# EAGLE design PIN2DMD (EAGLE 7.4.0)
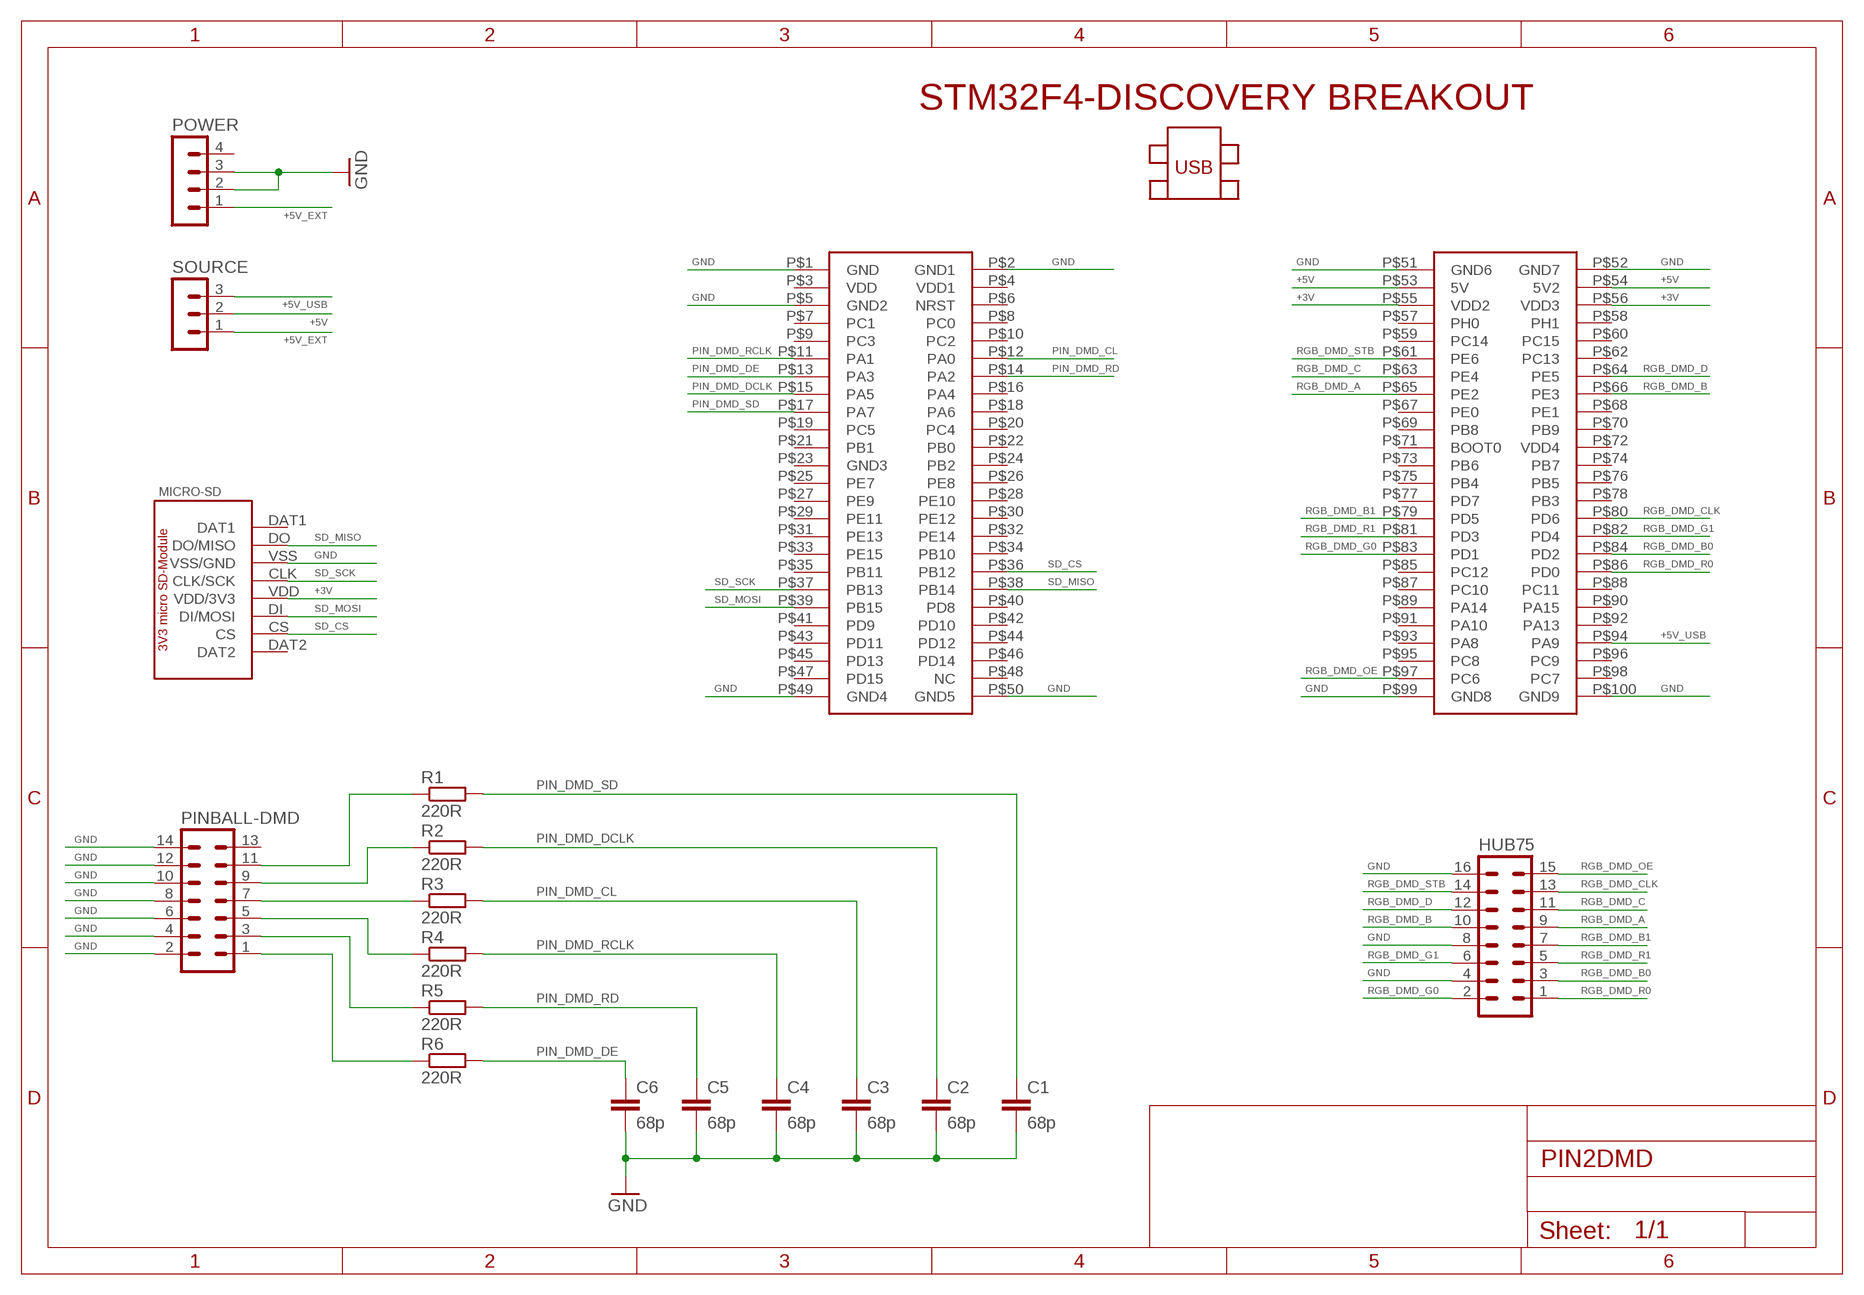
[diagram p0: schematic, sheet 1]

## Parts
C1  68p  C-EU025-024X044  [C025-024X044]
C2  68p  C-EU025-024X044  [C025-024X044]
C3  68p  C-EU025-024X044  [C025-024X044]
C4  68p  C-EU025-024X044  [C025-024X044]
C5  68p  C-EU025-024X044  [C025-024X044]
C6  68p  C-EU025-024X044  [C025-024X044]
HUB75  MA08-2  [MA08-2]
MICRO-SD  SPI_SDCARD_3V3_MICRO  [SPI_SDCARD_3V3_MICRO]
PINBALL-DMD  MA07-2  [MA07-2]
POWER  MA04-1  [MA04-1]
R1  220R  R-EU_0207/10  [0207/10]
R2  220R  R-EU_0207/10  [0207/10]
R3  220R  R-EU_0207/10  [0207/10]
R4  220R  R-EU_0207/10  [0207/10]
R5  220R  R-EU_0207/10  [0207/10]
R6  220R  R-EU_0207/10  [0207/10]
SOURCE  MA03-1  [MA03-1]
U$1  STM32F4-DISCOVERY  [STM32F4-DISCOVERY]

## Nets
+3V: MICRO-SD.VDD(VDD/3V3) U$1.P$55(VDD2) U$1.P$56(VDD3)
+5V: SOURCE.2 U$1.P$53(5V) U$1.P$54(5V2)
+5V_EXT: POWER.1 SOURCE.1
+5V_USB: SOURCE.3 U$1.P$94(PA9)
GND: C1.2 C2.2 C3.2 C4.2 C5.2 C6.2 HUB75.4 HUB75.8 HUB75.16 MICRO-SD.VSS(VSS/GND) PINBALL-DMD.2 PINBALL-DMD.4 PINBALL-DMD.6 PINBALL-DMD.8 PINBALL-DMD.10 PINBALL-DMD.12 PINBALL-DMD.14 POWER.2 POWER.3 U$1.P$1(GND) U$1.P$2(GND1) U$1.P$5(GND2) U$1.P$49(GND4) U$1.P$50(GND5) U$1.P$51(GND6) U$1.P$52(GND7) U$1.P$99(GND8) U$1.P$100(GND9)
N$5: PINBALL-DMD.7 R3.1
N$6: PINBALL-DMD.5 R4.1
N$11: PINBALL-DMD.3 R5.1
N$12: PINBALL-DMD.1 R6.1
N$13: PINBALL-DMD.9 R2.1
N$14: PINBALL-DMD.11 R1.1
PIN_DMD_CL: C3.1 R3.2 U$1.P$12(PA0)
PIN_DMD_DCLK: C2.1 R2.2 U$1.P$15(PA5)
PIN_DMD_DE: C6.1 R6.2 U$1.P$13(PA3)
PIN_DMD_RCLK: C4.1 R4.2 U$1.P$11(PA1)
PIN_DMD_RD: C5.1 R5.2 U$1.P$14(PA2)
PIN_DMD_SD: C1.1 R1.2 U$1.P$17(PA7)
RGB_DMD_A: HUB75.9 U$1.P$65(PE2)
RGB_DMD_B: HUB75.10 U$1.P$66(PE3)
RGB_DMD_B0: HUB75.3 U$1.P$84(PD2)
RGB_DMD_B1: HUB75.7 U$1.P$79(PD5)
RGB_DMD_C: HUB75.11 U$1.P$63(PE4)
RGB_DMD_CLK: HUB75.13 U$1.P$80(PD6)
RGB_DMD_D: HUB75.12 U$1.P$64(PE5)
RGB_DMD_G0: HUB75.2 U$1.P$83(PD1)
RGB_DMD_G1: HUB75.6 U$1.P$82(PD4)
RGB_DMD_OE: HUB75.15 U$1.P$97(PC6)
RGB_DMD_R0: HUB75.1 U$1.P$86(PD0)
RGB_DMD_R1: HUB75.5 U$1.P$81(PD3)
RGB_DMD_STB: HUB75.14 U$1.P$61(PE6)
SD_CS: MICRO-SD.CS U$1.P$36(PB12)
SD_MISO: MICRO-SD.DO(DO/MISO) U$1.P$38(PB14)
SD_MOSI: MICRO-SD.DI(DI/MOSI) U$1.P$39(PB15)
SD_SCK: MICRO-SD.CLK(CLK/SCK) U$1.P$37(PB13)
Unconnected: MICRO-SD.DAT1 MICRO-SD.DAT2 PINBALL-DMD.13 POWER.4 U$1.P$3(VDD) U$1.P$4(VDD1) U$1.P$6(NRST) U$1.P$7(PC1) U$1.P$8(PC0) U$1.P$9(PC3) U$1.P$10(PC2) U$1.P$16(PA4) U$1.P$18(PA6) U$1.P$19(PC5) U$1.P$20(PC4) U$1.P$21(PB1) U$1.P$22(PB0) U$1.P$23(GND3) U$1.P$24(PB2) U$1.P$25(PE7) U$1.P$26(PE8) U$1.P$27(PE9) U$1.P$28(PE10) U$1.P$29(PE11) U$1.P$30(PE12) U$1.P$31(PE13) U$1.P$32(PE14) U$1.P$33(PE15) U$1.P$34(PB10) U$1.P$35(PB11) U$1.P$40(PD8) U$1.P$41(PD9) U$1.P$42(PD10) U$1.P$43(PD11) U$1.P$44(PD12) U$1.P$45(PD13) U$1.P$46(PD14) U$1.P$47(PD15) U$1.P$48(NC) U$1.P$57(PH0) U$1.P$58(PH1) U$1.P$59(PC14) U$1.P$60(PC15) U$1.P$62(PC13) U$1.P$67(PE0) U$1.P$68(PE1) U$1.P$69(PB8) U$1.P$70(PB9) U$1.P$71(BOOT0) U$1.P$72(VDD4) U$1.P$73(PB6) U$1.P$74(PB7) U$1.P$75(PB4) U$1.P$76(PB5) U$1.P$77(PD7) U$1.P$78(PB3) U$1.P$85(PC12) U$1.P$87(PC10) U$1.P$88(PC11) U$1.P$89(PA14) U$1.P$90(PA15) U$1.P$91(PA10) U$1.P$92(PA13) U$1.P$93(PA8) U$1.P$95(PC8) U$1.P$96(PC9) U$1.P$98(PC7)

## Library data of the parts
C1-C6 = resistor:C-EU: CAPACITOR, European symbol
HUB75 = con-lstb:MA08-2: PIN HEADER
MICRO-SD = zzz_Sascha:SPI_SDCARD_3V3_MICRO: micro SD Card Modul 3V3
PINBALL-DMD = con-lstb:MA07-2: PIN HEADER
POWER = con-lstb:MA04-1: PIN HEADER
R1-R6 = rcl:R-EU_: RESISTOR, European symbol
SOURCE = con-lstb:MA03-1: PIN HEADER
U$1 = STM32F4-DISCOVERY:STM32F4-DISCOVERY

## Board
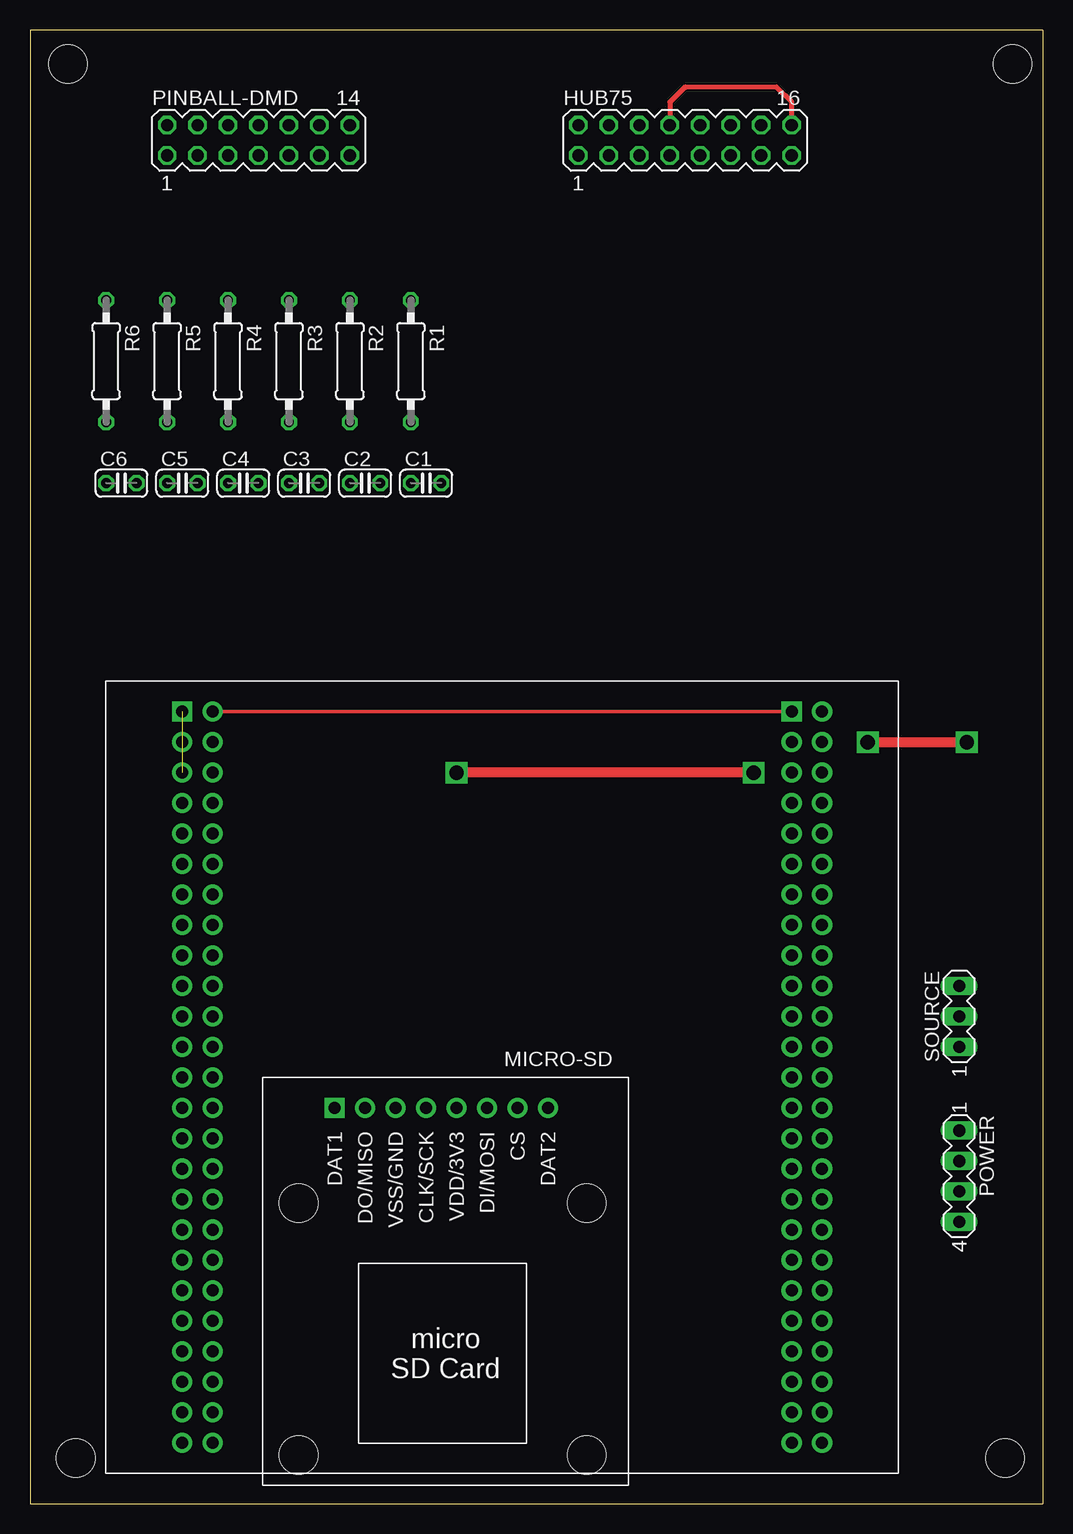
[diagram p1: board, top side]
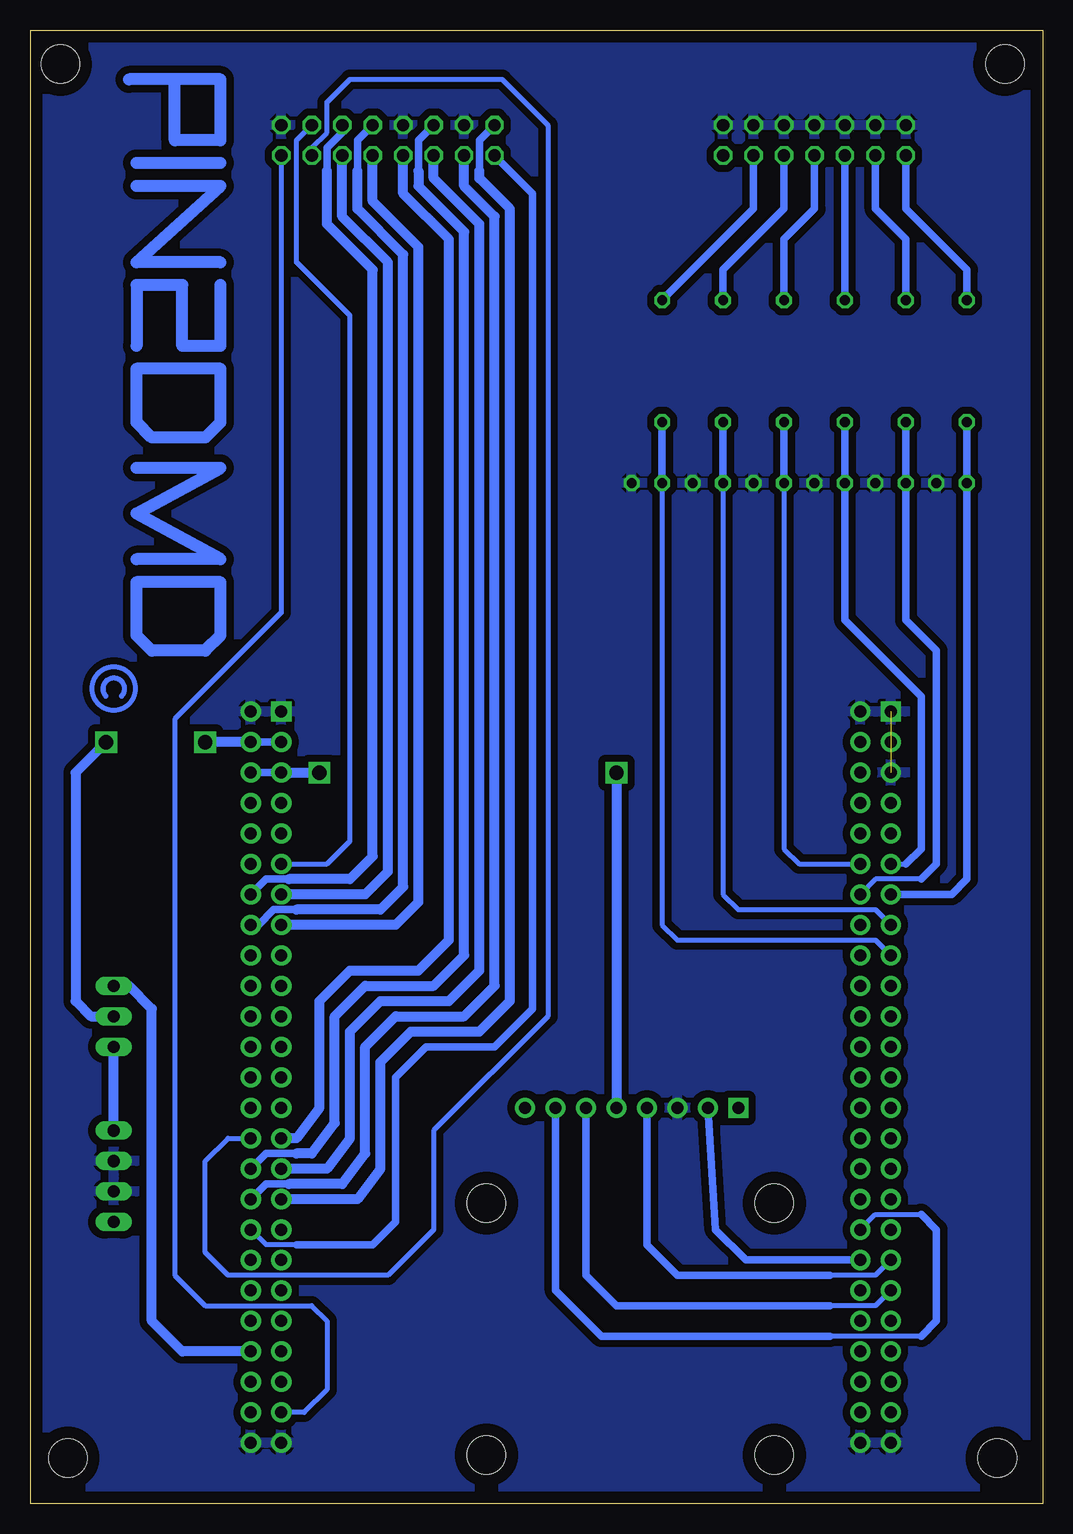
[diagram p2: board, bottom side, seen from below]

Size 84.45 x 122.86 mm. Coordinates in mm from the lower left corner, seen from the top.
Outline: 0,0 84.45,0 84.45,122.86 0,122.86 0,0
Copper layers (1*16): Top 0.035mm / dielectric 1.5mm / Bottom 0.035mm
Design rules "default": minimum track width 10mil, minimum drill 24mil, track to track 8mil, track to pad 8mil, pad to pad 8mil, via to via 8mil, smd to smd 8mil, copper to edge 40mil, drill to drill 8mil, minimum pad ring 10mil, minimum via ring 8mil, stop-mask expansion 4mil, vias tented up to drill 0mil, thermal gap 10mil
Holes 3.2 mm at 3.17,120.02 3.81,3.81 81.28,3.81 81.92,120.02

### Footprints (pad centres in the part's own frame; a part is rotated, then mirrored left to right if it is on the bottom)
C025-024X044 = drill 0.813 octagon: 1 -1.27,0; 2 1.27,0
MA08-2 = drill 1.016 octagon: 1 -8.89,-1.27; 2 -8.89,1.27; 3 -6.35,-1.27; 4 -6.35,1.27; 5 -3.81,-1.27; 6 -3.81,1.27; 7 -1.27,-1.27; 8 -1.27,1.27; 9 1.27,-1.27; 10 1.27,1.27; 11 3.81,-1.27; 12 3.81,1.27; 13 6.35,-1.27; 14 6.35,1.27; 15 8.89,-1.27; 16 8.89,1.27
SPI_SDCARD_3V3_MICRO = drill 1 pad 1.676: CLK -7.62,0; CS -15.24,0; DAT2 -17.78,0; DI -12.7,0; DO -2.54,0; VDD -10.16,0; VSS -5.08,0 | drill 1 pad 1.676 square: DAT1 0,0 | hole 3.2: -21,7.96; -21,28.96; 3,7.96; 3,28.96
MA07-2 = drill 1.016 octagon: 1 -7.62,-1.27; 2 -7.62,1.27; 3 -5.08,-1.27; 4 -5.08,1.27; 5 -2.54,-1.27; 6 -2.54,1.27; 7 0,-1.27; 8 0,1.27; 9 2.54,-1.27; 10 2.54,1.27; 11 5.08,-1.27; 12 5.08,1.27; 13 7.62,-1.27; 14 7.62,1.27
MA04-1 = drill 1.016 long: 1 -3.81,0; 2 -1.27,0; 3 1.27,0; 4 3.81,0
0207/10 = drill 0.813 octagon: 1 -5.08,0; 2 5.08,0
MA03-1 = drill 1.016 long: 1 -2.54,0; 2 0,0; 3 2.54,0
STM32F4-DISCOVERY = drill 1 pad 1.676 square: P$1 -27.94,30.48; P$51 22.86,30.48 | drill 1 pad 1.676: P$2 -25.4,30.48; P$3 -27.94,27.94; P$4 -25.4,27.94; P$5 -27.94,25.4; P$6 -25.4,25.4; P$7 -27.94,22.86; P$8 -25.4,22.86; P$9 -27.94,20.32; P$10 -25.4,20.32; P$11 -27.94,17.78; P$12 -25.4,17.78; P$13 -27.94,15.24; P$14 -25.4,15.24; P$15 -27.94,12.7; P$16 -25.4,12.7; P$17 -27.94,10.16; P$18 -25.4,10.16; P$19 -27.94,7.62; P$20 -25.4,7.62; P$21 -27.94,5.08; P$22 -25.4,5.08; P$23 -27.94,2.54; P$24 -25.4,2.54; P$25 -27.94,0; P$26 -25.4,0; P$27 -27.94,-2.54; P$28 -25.4,-2.54; P$29 -27.94,-5.08; P$30 -25.4,-5.08; P$31 -27.94,-7.62; P$32 -25.4,-7.62; P$33 -27.94,-10.16; P$34 -25.4,-10.16; P$35 -27.94,-12.7; P$36 -25.4,-12.7; P$37 -27.94,-15.24; P$38 -25.4,-15.24; P$39 -27.94,-17.78; P$40 -25.4,-17.78; P$41 -27.94,-20.32; P$42 -25.4,-20.32; P$43 -27.94,-22.86; P$44 -25.4,-22.86; P$45 -27.94,-25.4; P$46 -25.4,-25.4; P$47 -27.94,-27.94; P$48 -25.4,-27.94; P$49 -27.94,-30.48; P$50 -25.4,-30.48; P$52 25.4,30.48; P$53 22.86,27.94; P$54 25.4,27.94; P$55 22.86,25.4; P$56 25.4,25.4; P$57 22.86,22.86; P$58 25.4,22.86; P$59 22.86,20.32; P$60 25.4,20.32; P$61 22.86,17.78; P$62 25.4,17.78; P$63 22.86,15.24; P$64 25.4,15.24; P$65 22.86,12.7; P$66 25.4,12.7; P$67 22.86,10.16; P$68 25.4,10.16; P$69 22.86,7.62; P$70 25.4,7.62; P$71 22.86,5.08; P$72 25.4,5.08; P$73 22.86,2.54; P$74 25.4,2.54; P$75 22.86,0; P$76 25.4,0; P$77 22.86,-2.54; P$78 25.4,-2.54; P$79 22.86,-5.08; P$80 25.4,-5.08; P$81 22.86,-7.62; P$82 25.4,-7.62; P$83 22.86,-10.16; P$84 25.4,-10.16; P$85 22.86,-12.7; P$86 25.4,-12.7; P$87 22.86,-15.24; P$88 25.4,-15.24; P$89 22.86,-17.78; P$90 25.4,-17.78; P$91 22.86,-20.32; P$92 25.4,-20.32; P$93 22.86,-22.86; P$94 25.4,-22.86; P$95 22.86,-25.4; P$96 25.4,-25.4; P$97 22.86,-27.94; P$98 25.4,-27.94; P$99 22.86,-30.48; P$100 25.4,-30.48

### Placement (x,y rotation side)
C1  33.02,85.09 0 top
C2  27.94,85.09 0 top
C3  22.86,85.09 0 top
C4  17.78,85.09 0 top
C5  12.7,85.09 0 top
C6  7.62,85.09 0 top
HUB75  54.61,113.67 0 top
MICRO-SD  25.4,33.02 180 top
PINBALL-DMD  19.05,113.67 0 top
POWER  77.47,27.3 270 top
R1  31.75,95.25 270 top
R2  26.67,95.25 270 top
R3  21.59,95.25 270 top
R4  16.51,95.25 270 top
R5  11.43,95.25 270 top
R6  6.35,95.25 270 top
SOURCE  77.47,40.64 90 top
U$1  40.64,35.56 0 top

### Tracks (layer width: path | path; a pad name or v marks a point on that pad's centre or on a via)
+3V  (via drill 1.2)
  Top 0.813: v60.33,60.96 v35.56,60.96
  Bottom 0.61: U$1.P$55 U$1.P$56
  Bottom 0.813: U$1.P$55 v60.33,60.96 | v35.56,60.96 MICRO-SD.VDD
+5V  (via drill 1.2)
  Top 0.813: v69.85,63.5 v78.11,63.5
  Bottom 0.61: U$1.P$53 U$1.P$54
  Bottom 0.813: SOURCE.2 79.38,40.64 80.64,41.91 80.64,60.96 v78.11,63.5 | U$1.P$54 v69.85,63.5
+5V_EXT
  Bottom 0.813: POWER.1 SOURCE.1
+5V_USB
  Bottom 0.813: U$1.P$94 71.75,12.7 74.3,15.24 74.3,41.27 76.2,43.18 SOURCE.3
GND  (1 unrouted)
  Top 0.305: U$1.P$51 U$1.P$2
  Top 0.406: HUB75.16 63.5,116.84 62.23,118.11 54.61,118.11 53.34,116.84 HUB75.8
  pour Bottom (isolate 0.61): -0.64,123.19 84.45,123.19 84.45,-0.64 -0.64,-0.64
N$5
  Bottom 0.61: R3.1 21.59,105.41 19.05,107.95 PINBALL-DMD.7
N$6
  Bottom 0.61: R4.1 PINBALL-DMD.5
N$11
  Bottom 0.61: R5.1 11.43,105.41 13.97,107.95 PINBALL-DMD.3
N$12
  Bottom 0.61: R6.1 6.35,102.87 11.43,107.95 PINBALL-DMD.1
N$13
  Bottom 0.61: R2.1 26.67,102.87 21.59,107.95 PINBALL-DMD.9
N$14
  Bottom 0.61: R1.1 24.13,107.95 PINBALL-DMD.11
N$31
  Bottom 1.016: 72.39,118.75 76.2,118.75 | 72.39,118.75 68.58,118.75 68.58,113.67 72.39,113.67 72.39,118.75
N$32
  Bottom 1.016: 68.58,111.76 75.56,111.76
N$33
  Bottom 1.016: 75.56,109.86 68.58,109.86 75.56,103.5 68.58,103.5
N$34
  Bottom 1.016: 68.58,101.6 68.58,96.52 71.75,96.52 71.75,101.6 75.56,101.6 75.56,96.52
N$35
  Bottom 1.016: 68.58,94.61 75.56,94.61 75.56,90.17 74.3,88.9 69.85,88.9 68.58,90.17 68.58,94.61
N$36
  Bottom 1.016: 75.56,86.36 68.58,86.36 75.56,82.55 68.58,78.74 75.56,78.74
N$37
  Bottom 1.016: 68.58,76.83 75.56,76.83 75.56,72.39 74.3,71.12 69.85,71.12 68.58,72.39 68.58,76.83
N$38
  Bottom 0.406: 76.83,67.31 arc-270 78.11,67.31
PIN_DMD_CL
  Bottom 0.406: C3.1 21.59,54.61 20.32,53.34 U$1.P$12
  Bottom 0.61: R3.2 C3.1
PIN_DMD_DCLK
  Bottom 0.406: C2.1 26.67,50.8 25.4,49.53 13.97,49.53 U$1.P$15
  Bottom 0.61: R2.2 C2.1
PIN_DMD_DE
  Bottom 0.61: R6.2 C6.1 6.35,52.07 7.62,50.8 U$1.P$13
PIN_DMD_RCLK
  Bottom 0.406: U$1.P$11 11.43,53.34
  Bottom 0.61: R4.2 C4.1 16.51,73.66 10.16,67.31 10.16,54.61 11.43,53.34
PIN_DMD_RD
  Bottom 0.406: 10.16,52.07 13.97,52.07 U$1.P$14
  Bottom 0.61: R5.2 C5.1 11.43,73.66 8.89,71.12 8.89,53.34 10.16,52.07
PIN_DMD_SD
  Bottom 0.406: C1.1 31.75,48.26 30.48,46.99 13.97,46.99 U$1.P$17
  Bottom 0.61: R1.2 C1.1
RGB_DMD_A
  Bottom 0.813: U$1.P$65 53.98,48.26 52.07,50.16 52.07,104.78 55.88,108.58 HUB75.9
RGB_DMD_B
  Bottom 0.61: HUB75.10 57.15,113.67 57.15,111.12 | 62.23,49.53 64.14,49.53 65.41,48.26 U$1.P$66
  Bottom 0.813: 62.23,49.53 55.24,49.53 53.34,51.44 53.34,104.14 57.15,107.95 57.15,111.12
RGB_DMD_B0
  Bottom 0.61: U$1.P$84 64.77,26.67 62.87,26.67 62.23,26.67
  Bottom 0.813: 62.87,26.67 58.42,26.67 56.52,29.21 56.52,38.1 53.98,40.64 48.26,40.64 45.72,43.18 45.72,107.31 48.26,109.86 HUB75.3
RGB_DMD_B1
  Bottom 0.813: U$1.P$79 62.23,30.48 60.33,33.02 60.33,41.91 57.78,44.45 52.07,44.45 49.53,46.99 49.53,105.41 53.34,109.22 HUB75.7
RGB_DMD_C
  Bottom 0.813: U$1.P$63 56.52,50.8 54.61,52.7 54.61,103.5 58.42,107.31 HUB75.11
RGB_DMD_CLK
  Bottom 0.406: HUB75.13 60.96,113.03 59.69,114.3 59.69,116.84 57.78,118.75 45.09,118.75 41.27,114.94 41.27,40.64 50.8,31.11 50.8,22.86 54.61,19.05 67.94,19.05 69.85,20.95 69.85,28.57 67.94,30.48 U$1.P$80
RGB_DMD_D
  Bottom 0.61: 62.87,52.07 64.77,52.07 U$1.P$64 | 59.69,111.12 59.69,113.03 58.42,114.3 HUB75.12
  Bottom 0.813: 62.87,52.07 57.78,52.07 55.88,53.98 55.88,102.87 59.69,106.68 59.69,111.12
RGB_DMD_G0
  Bottom 0.61: 46.99,111.12 46.99,113.67 HUB75.2
  Bottom 0.813: U$1.P$83 57.15,25.4 55.24,27.94 55.24,36.83 52.7,39.37 46.99,39.37 44.45,41.91 44.45,107.95 46.99,110.49 46.99,111.12
RGB_DMD_G1
  Bottom 0.61: U$1.P$82 64.77,29.21 62.23,29.21 | HUB75.6 52.07,113.67 52.07,111.12
  Bottom 0.813: 62.23,29.21 60.96,29.21 59.05,31.75 59.05,40.64 56.52,43.18 50.8,43.18 48.26,45.72 48.26,106.05 52.07,109.86 52.07,111.12
RGB_DMD_OE
  Bottom 0.406: HUB75.15 63.5,74.3 72.39,65.41 72.39,19.05 69.85,16.51 60.96,16.51 59.69,15.24 59.69,9.53 61.59,7.62 U$1.P$97
RGB_DMD_R0
  Bottom 0.406: 62.23,21.59 64.77,21.59 U$1.P$86
  Bottom 0.61: HUB75.1 42.55,109.22 42.55,41.27 45.72,38.1 51.44,38.1 53.98,35.56 53.98,23.5 55.88,21.59 62.23,21.59
RGB_DMD_R1
  Bottom 0.813: U$1.P$81 59.69,27.94 57.78,30.48 57.78,39.37 55.24,41.91 49.53,41.91 46.99,44.45 46.99,106.68 50.8,110.49 HUB75.5
RGB_DMD_STB
  Bottom 0.406: U$1.P$61 59.69,53.34 57.78,55.24 57.78,99.06 62.23,103.5 62.23,113.67 HUB75.14
SD_CS
  Bottom 0.406: U$1.P$36 13.97,24.13 10.16,24.13 | 10.16,13.97 17.78,13.97
  Bottom 0.61: 10.16,13.97 8.89,15.24 8.89,22.86 10.16,24.13 | 17.78,13.97 36.83,13.97 40.64,17.78 MICRO-SD.CS
SD_MISO
  Bottom 0.61: U$1.P$38 24.77,20.32 27.3,22.86 MICRO-SD.DO
SD_MOSI
  Bottom 0.406: U$1.P$39 13.97,16.51 17.78,16.51
  Bottom 0.61: MICRO-SD.DI 38.1,19.05 35.56,16.51 17.78,16.51
SD_SCK
  Bottom 0.406: U$1.P$37 13.97,19.05 17.78,19.05
  Bottom 0.61: MICRO-SD.CLK 33.02,21.59 30.48,19.05 17.78,19.05
(copper drawn outside any net)
  shapes: Bottom circle x1